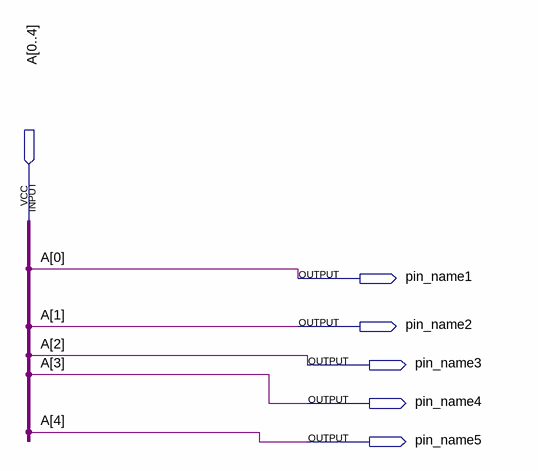
[diagram p0: schematic sheet]
// Quartus schematic in1_out4.bdf as structural Verilog: 0 symbols, 6 pins
module in1_out4 (
  input  [0:4] A,
  output pin_name1,
  output pin_name2,
  output pin_name3,
  output pin_name4,
  output pin_name5
);


  assign pin_name1 = A[0];
  assign pin_name2 = A[1];
  assign pin_name3 = A[2];
  assign pin_name4 = A[3];
  assign pin_name5 = A[4];
endmodule
